# EAGLE design BabyBoy (EAGLE 9.2.0)
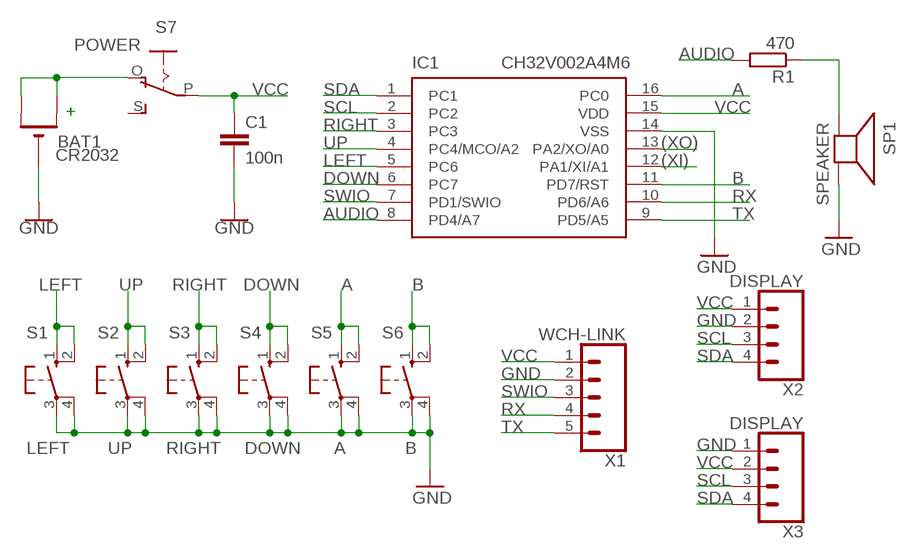
[diagram p0: schematic, sheet 1]

## Parts
BAT1  CR2032  CR2032THM  [CR2032-THRU]
C1  100n  C-EU050-024X044  [C050-024X044]
IC1  CH32V002A4M6  [SOP16]
R1  470  R-EU_0204/7  [0204/7]
S1  LEFT  10-XX  [B3F-10XX]
S2  UP  10-XX  [B3F-10XX]
S3  RIGHT  10-XX  [B3F-10XX]
S4  DOWN  10-XX  [B3F-10XX]
S5  A  10-XX  [B3F-10XX]
S6  B  10-XX  [B3F-10XX]
S7  POWER  EG1218S  [EG1218]
SP1  SPEAKER  SPEAKER/AL60P  [AL60P]
X1  WCH-LINK  CONN_05PTH_LONGPADS  [1X05_LONGPADS]
X2  DISPLAY  CONN_04  [1X04]
X3  DISPLAY  CONN_04  [1X04]

## Nets
(XI): IC1.12(PA1/XI/A1)
(XO): IC1.13(PA2/XO/A0)
A: IC1.16(PC0) S5.1(S) S5.2(S1)
AUDIO: IC1.8(PD4/A7) R1.2
B: IC1.11(PD7/RST) S6.1(S) S6.2(S1)
DOWN: IC1.6(PC7) S4.1(S) S4.2(S1)
GND: BAT1.- C1.2 IC1.14(VSS) S1.3(P) S1.4(P1) S2.3(P) S2.4(P1) S3.3(P) S3.4(P1) S4.3(P) S4.4(P1) S5.3(P) S5.4(P1) S6.3(P) S6.4(P1) SP1.2(-) X1.2 X2.2 X3.1
LEFT: IC1.5(PC6) S1.1(S) S1.2(S1)
N$2: R1.1 SP1.1(+)
RIGHT: IC1.3(PC3) S3.1(S) S3.2(S1)
RX: IC1.10(PD6/A6) X1.4
SCL: IC1.2(PC2) X2.3 X3.3
SDA: IC1.1(PC1) X2.4 X3.4
SWIO: IC1.7(PD1/SWIO) X1.3
TX: IC1.9(PD5/A5) X1.5
UP: IC1.4(PC4/MCO/A2) S2.1(S) S2.2(S1)
VBAT: BAT1.+1(+) BAT1.+2(+1) S7.O
VCC: C1.1 IC1.15(VDD) S7.P X1.1 X2.1 X3.2
Unconnected: S7.S

## Notes on the sheet
- +

## Library data of the parts
BAT1 = adafruit_ET58_LCD:CR2032
C1 = rcl:C-EU: CAPACITOR, European symbol; SPICEPREFIX: C
IC1 = CH32V:CH32V002A4M6
R1 = rcl:R-EU_: RESISTOR, European symbol; SPICEPREFIX: R
S1-S6 = switch-omron:10-XX: OMRON SWITCH; MPN: B3F-1000; OC_FARNELL: 176432; OC_NEWARK: 36M3542
S7 = CH32V:EG1218: SLIDING SWITCH 0.1" spacing through hole, vertical SPDT slide switch http://www.ladyada.net/library/pcb/eaglelibrary.html
SP1 = adafruit_watch:SPEAKER: SPEAKER Source: Buerklin Added PS12 (for part # PS1240 piezo) http://www.ladyada.net/library/pcb/eaglelibrary.html
X1 = SparkFun-Connectors:CONN_05: Multi connection point. Often used as Generic Header-pin footprint for 0.1 inch spaced/style header connections On any of the 0.1 inch spaced packages, you can populate with these: Break Away Headers - Straight <https://www.sparkfun.com/products/116> (PRT-00116) Break Away Male Headers - Right Angle <https://www.sparkfun.com/products/553> (PRT-00553) Female Headers <https://www.sparkfun.com/products/115> (PRT-00115) Break Away Headers - Machine Pin <https://www.sparkfun.com/products/117> (PRT-00117) Break Away Female Headers - Swiss Machine Pin <https://www.sparkfun.com/products/743> (PRT-00743) For SCREWTERMINALS and SPRING TERMINALS visit here: Screw Terimnals on SparkFun.com <https://www.sparkfun.com/search/results?term=Screw+Terminals> (5mm/3.5mm/2.54mm spacing) This device is also useful as a general connection point to wire up your design to another part of your project. Our various solder wires solder well into these plated through hole pads. Hook-Up Wire - Assortment (Stranded, 22 AWG) <https://www.sparkfun.com/products/11375> (PRT-11375) Hook-Up Wire - Assortment (Solid Core, 22 AWG) <https://www.sparkfun.com/products/11367> (PRT-11367) View the entire wire category on our website here <https://www.sparkfun.com/categories/141> Special notes: Molex polarized connector foot print use with SKU : PRT-08231 with associated crimp pins and housings. 1MM SMD Version SKU: PRT-10208
X2 X3 = SparkFun-Connectors:CONN_04: Multi connection point. Often used as Generic Header-pin footprint for 0.1 inch spaced/style header connections On any of the 0.1 inch spaced packages, you can populate with these: Break Away Headers - Straight <https://www.sparkfun.com/products/116> (PRT-00116) Break Away Male Headers - Right Angle <https://www.sparkfun.com/products/553> (PRT-00553) Female Headers <https://www.sparkfun.com/products/115> (PRT-00115) Break Away Headers - Machine Pin <https://www.sparkfun.com/products/117> (PRT-00117) Break Away Female Headers - Swiss Machine Pin <https://www.sparkfun.com/products/743> (PRT-00743) For SCREWTERMINALS and SPRING TERMINALS visit here: Screw Terimnals on SparkFun.com <https://www.sparkfun.com/search/results?term=Screw+Terminals> (5mm/3.5mm/2.54mm spacing) This device is also useful as a general connection point to wire up your design to another part of your project. Our various solder wires solder well into these plated through hole pads. Hook-Up Wire - Assortment (Stranded, 22 AWG) <https://www.sparkfun.com/products/11375> (PRT-11375) Hook-Up Wire - Assortment (Solid Core, 22 AWG) <https://www.sparkfun.com/products/11367> (PRT-11367) View the entire wire category on our website here <https://www.sparkfun.com/categories/141> Special notes: Molex polarized connector foot print use with SKU : PRT-08231 with associated crimp pins and housings. 1MM SMD Version SKU: PRT-10208; PROD_ID: CONN-09696

## Board
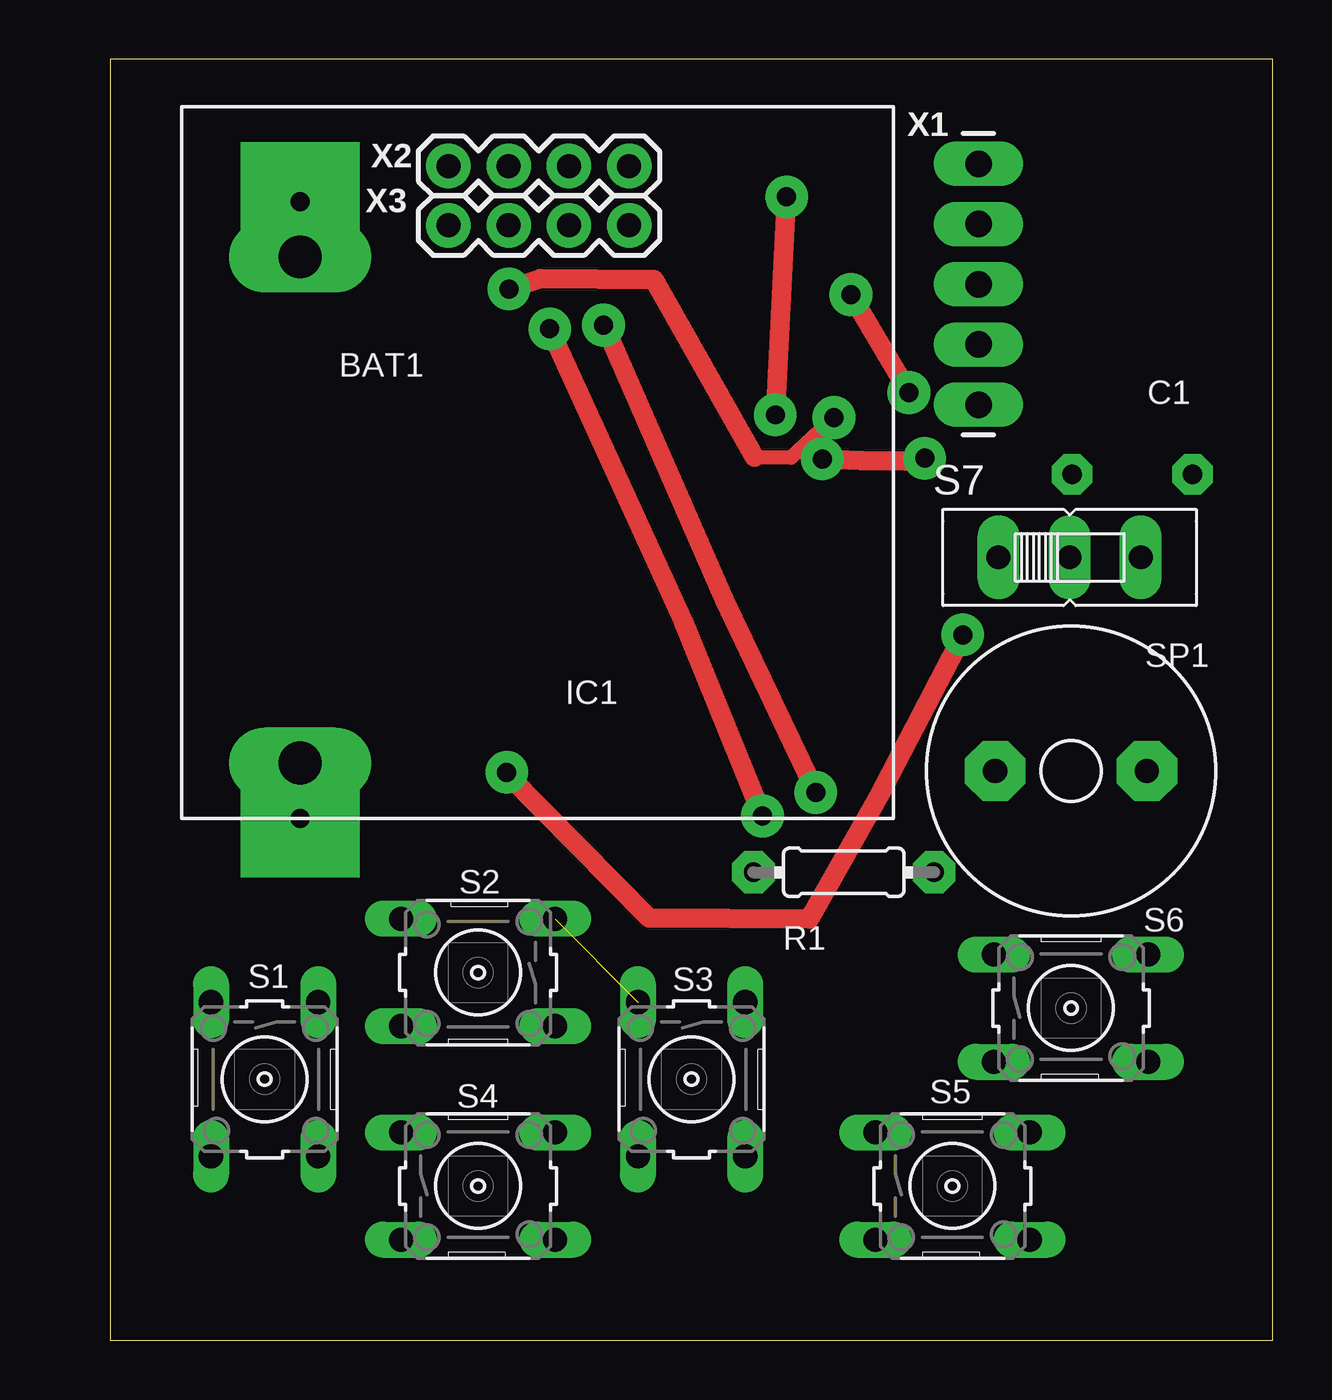
[diagram p1: board, top side]
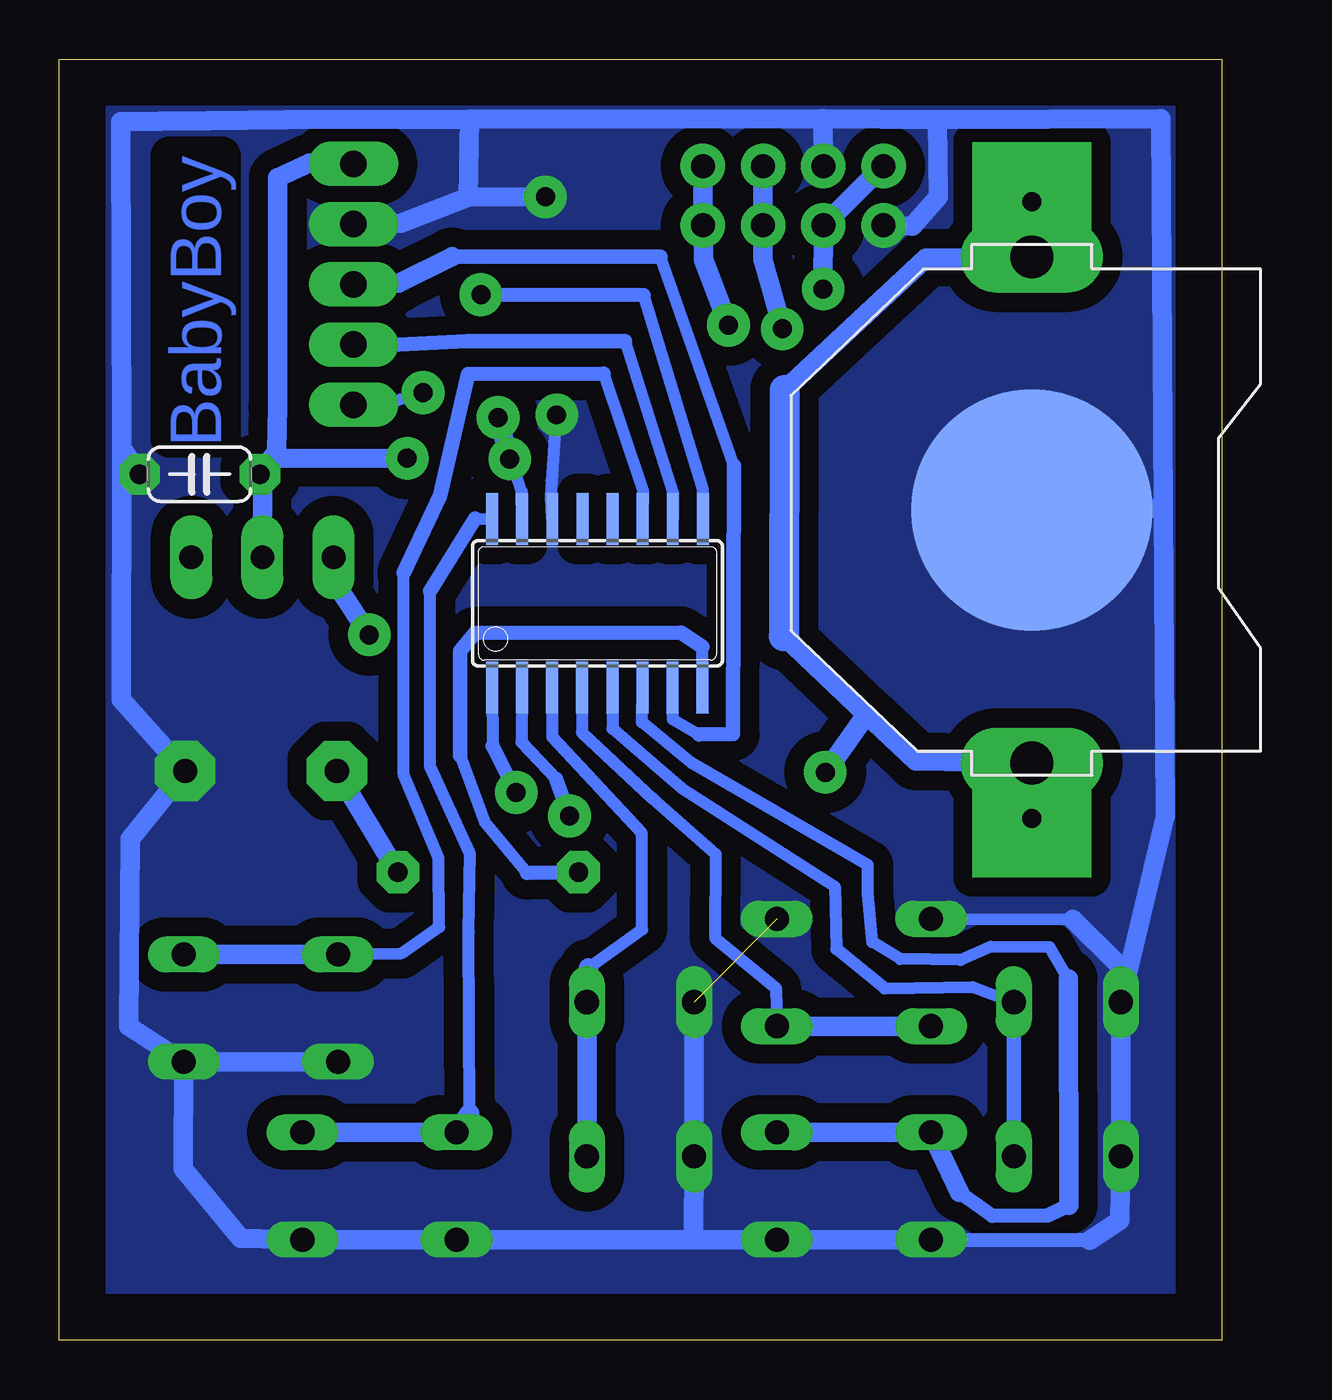
[diagram p2: board, bottom side, seen from below]

Size 49 x 54 mm. Coordinates in mm from the lower left corner, seen from the top.
Outline: 0,0 49,0 49,54 0,54 0,0
Copper layers (1*16): Top 0.035mm / dielectric 1.5mm / Bottom 0.035mm
Design rules "default": minimum track width 6mil, minimum drill 0.35mm, track to track 6mil, track to pad 6mil, pad to pad 6mil, via to via 6mil, smd to smd 6mil, copper to edge 40mil, drill to drill 6mil, minimum pad ring 10mil, minimum via ring 8mil, stop-mask expansion 4mil, vias tented up to drill 0mil, thermal gap 10mil

### Footprints (pad centres in the part's own frame; a part is rotated, then mirrored left to right if it is on the bottom)
CR2032-THRU = drill 1.8 pad 3 long: +1 -10.668,0; +2 10.668,0 | smd 10.16 x 10.16: - 0,0
C050-024X044 = drill 0.813 pad 1.7 octagon: 1 -2.54,0; 2 2.54,0
SOP16 = smd 0.5 x 2.2: 1 -4.445,-3.55; 2 -3.185,-3.55; 3 -1.915,-3.55; 4 -0.645,-3.55; 5 0.635,-3.55; 6 1.895,-3.55; 7 3.165,-3.55; 8 4.435,-3.55; 9 4.445,3.55; 10 3.175,3.55; 11 1.905,3.55; 12 0.635,3.55; 13 -0.635,3.55; 14 -1.905,3.55; 15 -3.175,3.55; 16 -4.445,3.55
0204/7 = drill 0.813 pad 1.8 octagon: 1 -3.81,0; 2 3.81,0
B3F-10XX = drill 1.016 long: 1 -3.251,2.261; 2 3.251,2.261; 3 -3.251,-2.261; 4 3.251,-2.261
EG1218 = drill 1 pad 1.778 long: O -3,0; P 0,0; S 3,0
AL60P = drill 1.016 pad 2.54 octagon: 1 -3.2,0; 2 3.2,0
1X05_LONGPADS = drill 1.118 pad 1.88 long: 1 0,0; 2 2.54,0; 3 5.08,0; 4 7.62,0; 5 10.16,0
1X04 = drill 1.016 pad 1.88: 1 0,0; 2 2.54,0; 3 5.08,0; 4 7.62,0

### Placement (x,y rotation side)
BAT1  8,35 270 bottom
C1  43.08,36.51 180 bottom
IC1  26.31,31.07 0 bottom
R1  30.92,19.73 180 top
S1  6.5,11 270 top
S2  15.5,15.5 180 top
S3  24.5,11 270 top
S4  15.5,6.5 0 top
S5  35.5,6.5 0 top
S6  40.5,14 0 top
S7  40.44,33 0 top
SP1  40.5,24 0 top
X1  36.59,49.59 270 top
X2  14.25,49.5 0 top
X3  14.25,47 0 top

### Tracks (layer width: path | path; a pad name or v marks a point on that pad's centre or on a via)
A
  Bottom 0.508: 31.71,9.55 31.74,17.22 31.69,20.52 33.37,24.22 33.36,31.57 | 31.46,34.63 IC1.16
  Bottom 0.61: 33.36,31.57 31.46,34.63
  Bottom 0.813: S5.2 S5.1 31.71,9.55
AUDIO
  Bottom 0.508: IC1.8 21.88,29.23 | 32.1,24.64 31.06,21.85 29.28,19.7
  Bottom 0.61: 21.88,29.23 22.79,29.82 31.48,29.81 32.1,29.05 32.1,24.64 | 29.28,19.7 R1.2
B
  Bottom 0.508: S6.1 34.57,16.31 32.99,17.41 33.02,20.33 34.48,23.84 34.48,32.35 | 26.06,40.75 24.38,35.79 IC1.11
  Bottom 0.61: 34.48,32.35 32.94,35.6 31.76,40.73 26.06,40.75
  Bottom 0.813: S6.2 S6.1
DOWN
  Bottom 0.508: 6.46,15.24 7.25,16.56 9.74,16.58 11,16.02 13.55,16.07 14.72,16.79 14.92,18.84 14.91,20.04 22.37,24.35 24.44,26.06 IC1.6
  Bottom 0.61: 11.04,6.23 9.66,5.24 7.32,5.28 6.44,5.69
  Bottom 0.813: S4.2 S4.1 11.04,6.23 | 6.44,5.69 6.46,15.24
GND  (via drill 0.8 pad 1.8)  (1 unrouted)
  Top 0.813: v28.03,39.01 v28.51,48.2
  Bottom 0.508: S2.4 6.26,17.75 | 4.37,15.86 S1.3 | IC1.14 28.26,35.56 v28.03,39.01
  Bottom 0.61: S4.3 5.54,4.22
  Bottom 0.813: 6.26,17.75 4.37,15.86 | S6.4 46.06,13.24 46.01,21.13 SP1.2 46.39,27.02 46.37,37.64 | S6.4 S6.3 | S6.4 43.78,7.22 41.35,4.3 S5.4 S5.3 22.26,4.24 | 22.26,4.24 S4.4 S4.3 | 5.54,4.22 4.29,5.05 S1.4 S1.3 2.38,22.11 2.46,35.09 | 22.26,4.24 S3.4 S3.3 | 2.46,35.09 2.56,51.5 11.97,51.45 | 11.97,51.45 16.8,51.48 | 16.8,51.48 31.71,51.47 | 31.71,51.47 39.43,51.46 42.69,51.42 44.76,51.39 46.4,51.37 46.37,37.64 | BAT1.- 2.46,35.09 | X2.2 16.8,51.48 | X3.1 13.03,46.97 11.94,48.21 11.97,51.45 | C1.2 46.37,37.64 | X1.2 34.6,47.09 31.76,48.19 | 31.76,48.19 31.71,51.47 | v28.51,48.2 31.76,48.19
  pour Bottom (isolate 0.813, no thermals): 2,2 2,52 47,52 47,2
LEFT
  Bottom 0.508: IC1.5 25.68,25.78 22.77,23.29 16.31,19.12 16.24,16.49 14.2,14.83 10.49,14.89 S1.1
  Bottom 0.61: S1.2 S1.1
N$2
  Bottom 0.813: R1.1 SP1.1
RIGHT
  Bottom 0.508: 26.68,15.71 24.42,17.31 24.44,21.38 28.21,25.42 IC1.3
  Bottom 0.813: S3.2 S3.1 26.68,15.71
RX
  Bottom 0.508: 25.15,42.13 23.12,35.71 IC1.10
  Bottom 0.61: X1.4 34.72,41.98 31.81,42.11 25.15,42.13
SCL  (via drill 0.8 pad 1.8)
  Top 0.813: v27.49,22.1 24.14,30.34 v18.52,42.64
  Bottom 0.508: IC1.2 29.51,25.21 28.06,23.66
  Bottom 0.61: 28.06,23.66 v27.49,22.1
  Bottom 0.813: X2.3 X3.3 19.33,45.55 v18.52,42.64
SDA  (via drill 0.8 pad 1.8)
  Top 0.61: 20.82,42.77 v20.79,42.79
  Top 0.813: v29.74,23.09 25.89,31.2 20.82,42.77
  Bottom 0.508: IC1.1 30.74,25.05
  Bottom 0.61: 30.74,25.05 v29.74,23.09
  Bottom 0.813: X2.4 X3.4 21.85,45.56 v20.79,42.79
SWIO
  Bottom 0.508: IC1.7 23.14,26.18 22.04,25.54 | 20.55,36.87 23.66,45.69
  Bottom 0.61: 22.04,25.54 20.59,25.55 20.55,36.87 | 23.66,45.69 32.45,45.68
  Bottom 0.813: 32.45,45.68 34.69,44.55 X1.3
TX  (via drill 0.8 pad 1.8)
  Top 0.813: v31.22,44.08 v33.66,39.95
  Bottom 0.508: IC1.9 21.87,35.84 24.38,44.06 | v33.66,39.95 35.07,39.52 X1.5
  Bottom 0.61: 24.38,44.06 v31.22,44.08
UP
  Bottom 0.508: IC1.4 26.97,25.62 23.99,22.85 21.33,20.5 21.35,16.95 18.78,14.83 S2.1
  Bottom 0.813: S2.1 S2.2
VBAT  (via drill 0.8 pad 1.8, 0.8 pad 5)
  Top 0.508: 16.71,23.89 v16.71,23.94
  Top 0.813: v35.93,29.73 32.37,22.89 29.47,17.77 22.7,17.8 16.71,23.89
  Bottom 0.813: 18.42,40.06 12.47,45.63 BAT1.+1 v8,48 | 18.45,29.68 14.97,26.39 | 14.97,26.39 12.89,24.41 BAT1.+2 v8,22 | S7.O 37.42,32.01 v35.93,29.73 | v16.71,23.94 14.97,26.39
  Bottom 1.27: 18.42,40.06 18.45,29.68
VCC  (via drill 0.8 pad 1.8)
  Top 0.61: 27.16,37.23 28.7,37.22 v30.5,38.89
  Top 0.813: v30.01,37.15 31.65,37.09 33.54,37.06 v34.33,37.18 | v16.8,44.32 18.12,44.75 22.93,44.71 27.16,37.23
  Bottom 0.508: 39.84,37.5 C1.1 | IC1.15 29.51,35.78 29.74,36.52 v30.01,37.15
  Bottom 0.813: X2.1 X3.2 v16.8,44.32 | S7.P 40.42,36.49 39.84,37.5 39.8,39.36 39.79,49 38.47,49.63 X1.1 | v34.33,37.18 40.08,37.18 C1.1 | v30.5,38.89 v30.01,37.15

### Text on the board
Bottom: BabyBoy
Document: VCC-GND | +5V | GND | GND-VCC | SWIO | RX | TX